# Altium schematic sheet MCU copy.SchDoc
size 293 x 185 mm
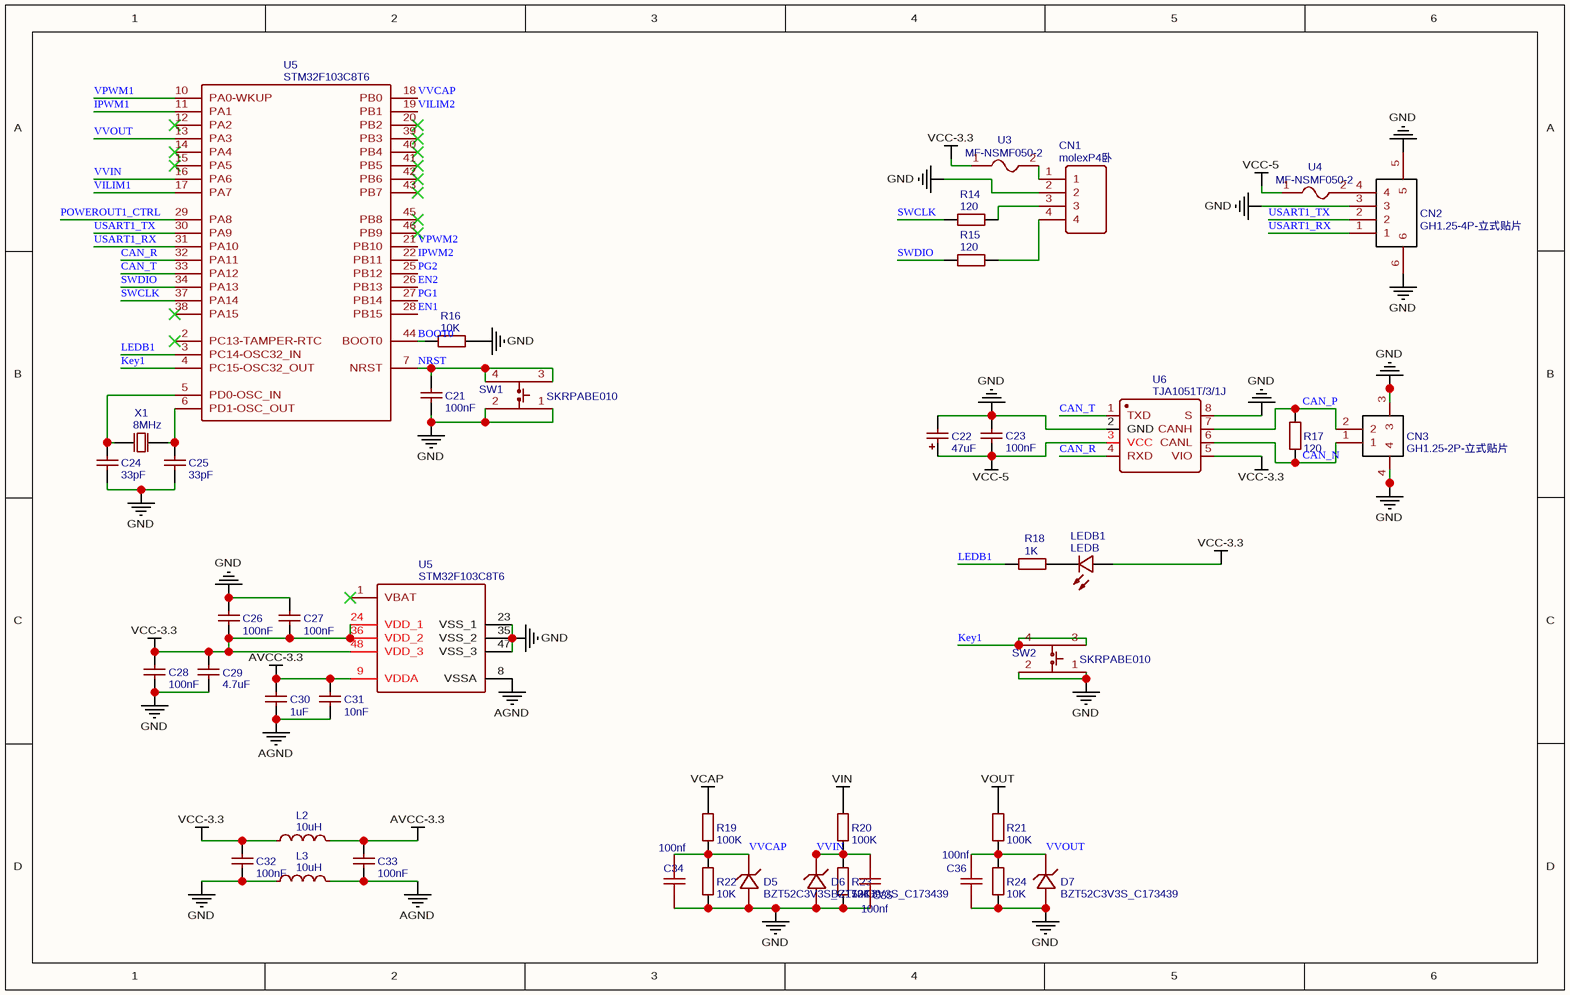
[diagram p0: MCU copy.SchDoc]

## Parts
(Parts that share a designator on the sheet are numbered #1, #2 ... from top to bottom, then left to right.)
C21  100nF  [C0603]
C22  47uF  [CASE-A_3216]
C23  100nF  [R0603]
C24  33pF  [C0603]
C25  33pF  [C0603]
C26  100nF  [C0603]
C27  100nF  [C0603]
C28  100nF  [C0603]
C29  4.7uF  [C0603]
C30  1uF  [C0603]
C31  10nF  [C0603]
C32  100nF  [C0603]
C33  100nF  [C0603]
C34  100nf  [C0603]
C35  100nf  [C0603]
C36  100nf  [C0603]
CN1  molexP4卧  [SMD-10.15X4.8-4P]
CN2  GH1.25-4P-立式贴片  [SMD-1.25MM-4P-JST-H4.05]
CN3  GH1.25-2P-立式贴片  [SMD-1.25MM-2P-JST-H4.05]
D5  BZT52C3V3S_C173439  [SOD-323_L1.8-W1.3-LS2.5-RD]
D6  BZT52C3V3S_C173439  [SOD-323_L1.8-W1.3-LS2.5-RD]
D7  BZT52C3V3S_C173439  [SOD-323_L1.8-W1.3-LS2.5-RD]
L2  10uH  [L0603]
L3  10uH  [L0603]
LEDB1  LEDB  [LED-0603]
R14  120  [R0402]
R15  120  [R0402]
R16  10K  [R0402]
R17  120  [R0402]
R18  1K  [R0603]
R19  100K  [R0402]
R20  100K  [R0402]
R21  100K  [R0402]
R22  10K  [R0402]
R23  10K  [R0402]
R24  10K  [R0402]
SW1  SKRPABE010  [KEY-SMD-4P_L4.2-W3.2-H2.5]
SW2  SKRPABE010  [KEY-SMD-4P_L4.2-W3.2-H2.5]
U3  MF-NSMF050-2  [FUSE-1206]
U4  MF-NSMF050-2  [FUSE-1206]
U5#1  STM32F103C8T6  [LQFP-48_7X7X05P]
U5#2  STM32F103C8T6  [LQFP-48_7X7X05P]
U6  TJA1051T/3/1J  [SOIC-8_150MIL]
X1  8MHz  [SMD-5032_2P]

## Nets
AGND: C30.1 C31.1 C33.1 L3.2 U5#2.8(VSSA)
AVCC-3.3: C30.2 C31.2 C33.2 L2.2 U5#2.9(VDDA)
GND: C21.1 C22.2 C23.2 C24.1 C25.1 C26.1 C27.2 C28.1 C29.1 C32.1 C34.1 C35.1 C36.1 CN1.2 CN2.3 CN2.5 CN2.6 CN3.3 CN3.4 D5.2 D6.2 D7.2 L3.1 R16.1 R22.1 R23.1 R24.1 SW1.1 SW1.2 SW2.1 SW2.2 U5#2.23(VSS_1) U5#2.35(VSS_2) U5#2.47(VSS_3) U6.2(GND) U6.8(S)
VCAP: R19.2
VCC-3.3: C26.2 C27.1 C28.2 C29.2 C32.2 L2.1 LEDB1.1(A) U3.1 U5#2.24(VDD_1) U5#2.36(VDD_2) U5#2.48(VDD_3) U6.5(VIO)
VCC-5: C22.1 C23.1 U4.1 U6.3(VCC)
VIN: R20.2
VOUT: R21.2
BOOT0: R16.2 U5#1.44(BOOT0)
CAN_N: CN3.1 R17.2 U6.6(CANL)
CAN_P: CN3.2 R17.1 U6.7(CANH)
CAN_R: U5#1.32(PA11) U6.4(RXD)
CAN_T: U5#1.33(PA12) U6.1(TXD)
EN1: U5#1.28(PB15)
EN2: U5#1.26(PB13)
IPWM1: U5#1.11(PA1)
IPWM2: U5#1.22(PB11)
Key1: SW2.3 SW2.4 U5#1.4(PC15-OSC32_OUT)
LEDB1: R18.1 U5#1.3(PC14-OSC32_IN)
NRST: C21.2 SW1.3 SW1.4 U5#1.7(NRST)
PG1: U5#1.27(PB14)
PG2: U5#1.25(PB12)
POWEROUT1_CTRL: U5#1.29(PA8)
SWCLK: R14.2 U5#1.37(PA14)
SWDIO: R15.2 U5#1.34(PA13)
USART1_RX: CN2.1 U5#1.31(PA10)
USART1_TX: CN2.2 U5#1.30(PA9)
VILIM1: U5#1.17(PA7)
VILIM2: U5#1.19(PB1)
VPWM1: U5#1.10(PA0-WKUP)
VPWM2: U5#1.21(PB10)
VVCAP: C34.2 D5.1 R19.1 R22.2 U5#1.18(PB0)
VVIN: C35.2 D6.1 R20.1 R23.2 U5#1.16(PA6)
VVOUT: C36.2 D7.1 R21.1 R24.2 U5#1.13(PA3)
NetC24_2: C24.2 U5#1.5(PD0-OSC_IN) X1.1(OSC1)
NetC25_2: C25.2 U5#1.6(PD1-OSC_OUT) X1.2(OSC2)
NetCN1_1: CN1.1 U3.2
NetCN1_3: CN1.3 R14.1
NetCN1_4: CN1.4 R15.1
NetCN2_4: CN2.4 U4.2
NetLEDB1_2: LEDB1.2(C) R18.2

Not connected (* = marked no-connect by the designer): U5#1 2(PC13-TAMPER-RTC)* 12(PA2)* 14(PA4)* 15(PA5)* 20(PB2)* 38(PA15)* 39(PB3)* 40(PB4)* 41(PB5)* 42(PB6)* 43(PB7)* 45(PB8)* 46(PB9)*; U5#2 1(VBAT)*

## Library data of the parts
C21 C23 C26-C28 C32 C33 = 100nF: BOM_Manufacturer Part: CL05B104KO5NNNC; BOM_Manufacturer: SAMSUNG; nameAlias: Capacitance; BOM_Supplier: LCSC; BOM_LCSC Assembly: Yes; BOM_Supplier Part: C1525; spicePre: C; spiceSymbolName: CL05B104KO5NNNC
C22 = 47uF: BOM_Manufacturer: Xiangyee; BOM_Manufacturer Part: CA45-A010K476T; nameAlias: Capacitance; Contributor: LCSC; BOM_Supplier: LCSC; BOM_Supplier Part: C127069; BOM_LCSC Assembly: Yes; spicePre: C; spiceSymbolName: CA45-A010K476T
C24 C25 = 33pF: BOM_Manufacturer Part: CL05C330JB5NNNC; BOM_Manufacturer: SAMSUNG; nameAlias: Capacitance; BOM_Supplier: LCSC; BOM_Supplier Part: C70465; spicePre: C; spiceSymbolName: CL05C330JB5NNNC
C29 = 4.7uF: BOM_Manufacturer Part: CL10A475KO8NNNC; BOM_Manufacturer: SAMSUNG; nameAlias: Capacitance; SMT Type: Basic; BOM_Supplier: LCSC; BOM_LCSC Assembly: Yes; BOM_Supplier Part: C19666; spicePre: C; spiceSymbolName: CL10A475KO8NNNC
C30 = 1uF: BOM_Manufacturer Part: CL10A105KB8NNNC; BOM_Manufacturer: SAMSUNG; nameAlias: Capacitance; BOM_Supplier: LCSC; BOM_LCSC Assembly: Yes; BOM_Supplier Part: C15849; spicePre: C; spiceSymbolName: CL10A105KB8NNNC
C31 = 10nF: BOM_Manufacturer Part: CL05B103KB5NNNC; BOM_Manufacturer: SAMSUNG; nameAlias: Capacitance; BOM_Supplier: LCSC; BOM_LCSC Assembly: Yes; BOM_Supplier Part: C15195; spicePre: C; spiceSymbolName: CL05B103KB5NNNC
C34-C36 = 100nf: nameAlias: Value(F); spicePre: C; spiceSymbolName: Cap_0402_US
CN1 = molexP4卧: BOM_Manufacturer: MOLEX; BOM_Manufacturer Part: 532610471; BOM_Supplier: LCSC; BOM_Supplier Part: C127368; spicePre: C
CN2 = GH1.25-4P-立式贴片: BOM_Manufacturer: JST Sales America; BOM_Manufacturer Part: BM04B-GHS-TBT(LF)(SN); Contributor: LCSC; BOM_Supplier: LCSC; BOM_Supplier Part: C161692; spicePre: C
CN3 = GH1.25-2P-立式贴片: BOM_Manufacturer: JST Sales America; BOM_Manufacturer Part: BM02B-GHS-TBT (LF)(SN); Contributor: LCSC; BOM_Supplier: LCSC; BOM_Supplier Part: C161690; spicePre: C
D5-D7 = BZT52C3V3S_C173439: BOM_Manufacturer: (MDD) Jiangsu Yutai Elec; Contributor: LCSC; SMT Type: Extend; BOM_Supplier: LCSC; BOM_Supplier Part: C173439; BOM_Manufacturer Part: BZT52C3V3S; BOM_LCSC Assembly: Yes; spicePre: D; spiceSymbolName: BZT52C3V3S_C173439
L2 L3 = 10uH: BOM_Manufacturer: Sunlord; BOM_Manufacturer Part: SDFL2012S100KTF; nameAlias: Inductance; SMT Type: Basic; BOM_Supplier: LCSC; BOM_LCSC Assembly: Yes; BOM_Supplier Part: C1046; spicePre: L; spiceSymbolName: SDFL2012S100KTF
LEDB1 = LEDB: BOM_Manufacturer: EVERLIGHT; BOM_Supplier: LCSC; BOM_LCSC Assembly: Yes; BOM_Supplier Part: C72041; spicePre: L
R14 R15 R17 = 120: BOM_Manufacturer: UniOhm; BOM_Manufacturer Part: 0402WGF1200TCE; nameAlias: Resistance (Ohms); BOM_Supplier: LCSC; BOM_LCSC Assembly: Yes; BOM_Supplier Part: C25079; spicePre: R; spiceSymbolName: 0402WGF1200TCE
R16 R22-R24 = 10K: BOM_Manufacturer: UniOhm; BOM_Manufacturer Part: 0402WGF1002TCE; nameAlias: Resistance (Ohms); SMT Type: Basic; BOM_Supplier: LCSC; BOM_LCSC Assembly: Yes; BOM_Supplier Part: C25744; spicePre: R; spiceSymbolName: 0402WGF1002TCE
R18 = 1K: BOM_Manufacturer: UniOhm; BOM_Manufacturer Part: 0402WGF1001TCE; nameAlias: Resistance (Ohms); SMT Type: Basic; BOM_Supplier: LCSC; BOM_LCSC Assembly: Yes; BOM_Supplier Part: C11702; spicePre: R; spiceSymbolName: 0402WGF1001TCE
R19-R21 = 100K: BOM_Manufacturer: UniOhm; BOM_Manufacturer Part: 0402WGF1003TCE; nameAlias: Resistance (Ohms); SMT Type: Basic; BOM_Supplier: LCSC; BOM_LCSC Assembly: Yes; BOM_Supplier Part: C25741; spicePre: R; spiceSymbolName: 0402WGF1003TCE
SW1 SW2 = SKRPABE010: BOM_Manufacturer: ALPS; BOM_Supplier: LCSC; BOM_Manufacturer Part: SKRPABE010; BOM_Supplier Part: C115360; spicePre: S
U3 U4 = MF-NSMF050-2: BOM_Manufacturer: BOURNS; BOM_Supplier: LCSC; BOM_Manufacturer Part: MF-NSMF050-2; BOM_Supplier Part: C75464; BOM_LCSC Assembly: Yes; spicePre: U
U5#1 U5#2 = STM32F103C8T6: BOM_Manufacturer: ST; subpart_no: 1; tags: STM32; timeStamp: 1455028086; BOM_Supplier Part: C8734; BOM_Supplier: LCSC; BOM_Manufacturer Part: STM32F103C8T6; image: http://image.lceda.cn/szlcsc/C8734.jpg; spicePre: U
U6 = TJA1051T/3/1J: BOM_Manufacturer: NXP; BOM_Supplier: LCSC; BOM_Manufacturer Part: TJA1051T/3/1J; BOM_LCSC Assembly: Yes; image: //image.lceda.cn/szlcsc/C38695.jpg; BOM_Supplier Part: C38695; spicePre: U
X1 = 8MHz: BOM_Manufacturer: Yangxing Tech; BOM_Manufacturer Part: X50328MSD2GC; nameAlias: Frequency; Contributor: LCSC; BOM_Supplier: LCSC; BOM_Supplier Part: C172361; BOM_LCSC Assembly: Yes; spicePre: X; spiceSymbolName: X50328MSD2GC_C172361